# Altium project PROC051C_AWR1843BOOST_RevC.PrjPcb (part 1 of 7)
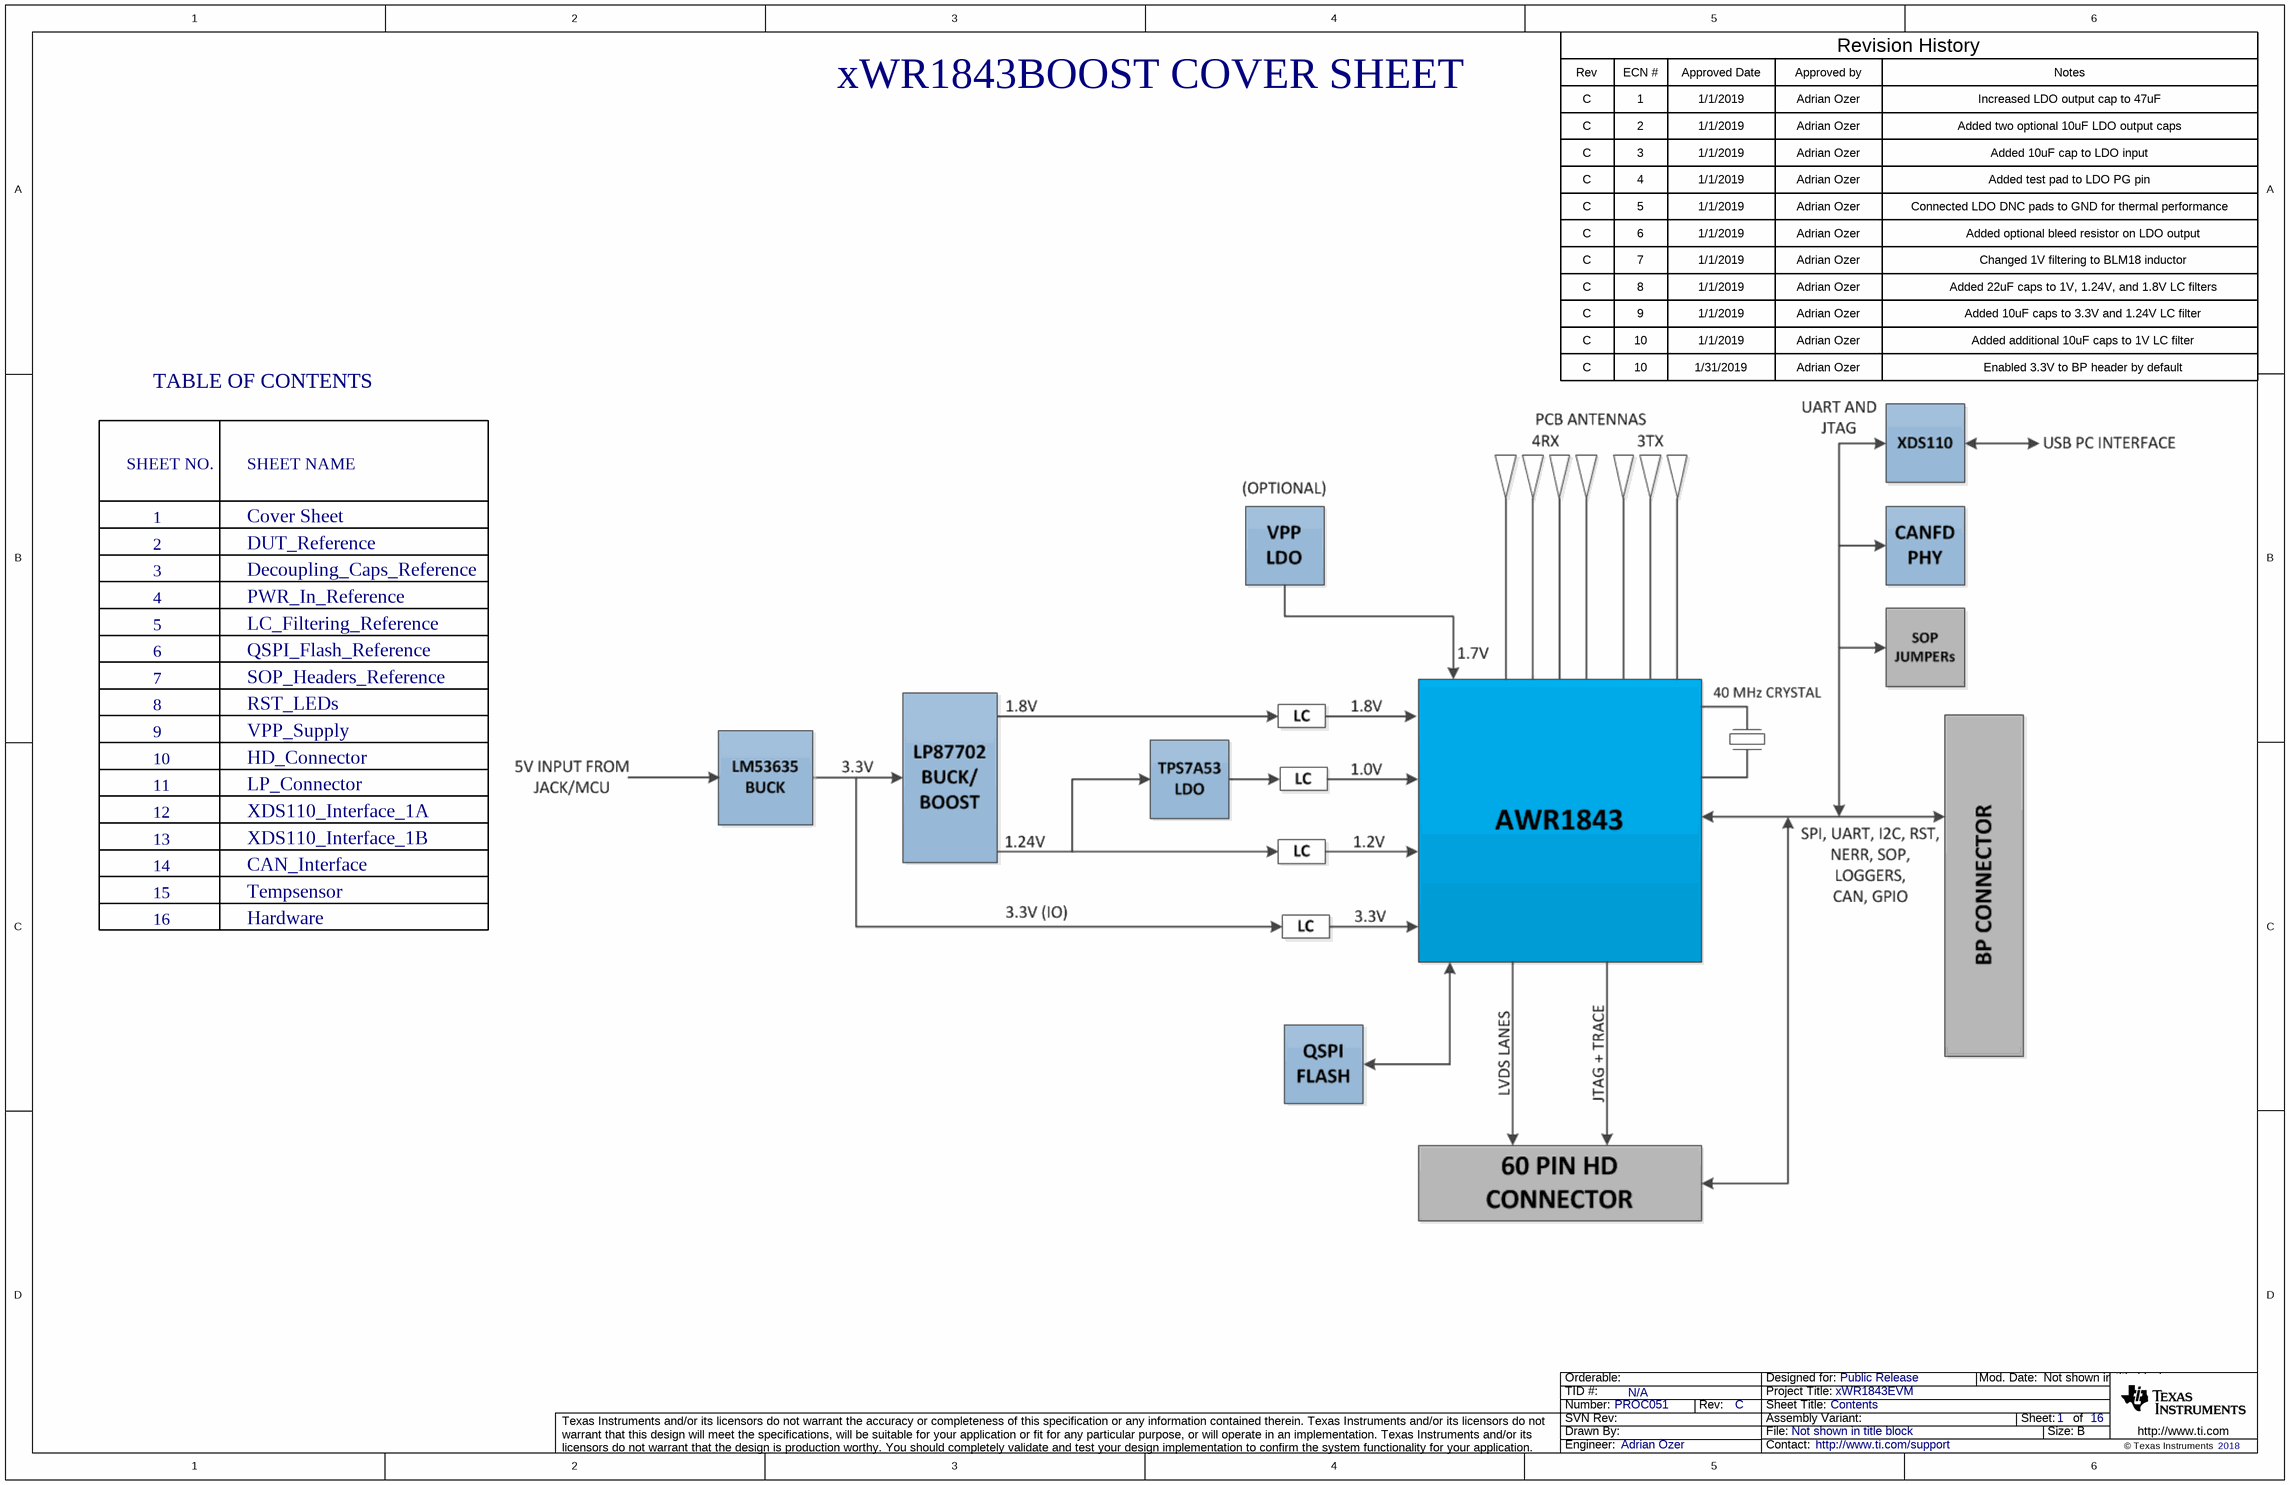
[diagram p0: PROC051C_Cover_Sheet.SchDoc]
CopyrightYear: 2018; PCB_Layout: Adrian Ozer; PCB_Rev: C; PRJ_Customer: Public Release; PRJ_Engineer: Adrian Ozer; PRJ_Number: PROC051; PRJ_Title: xWR1843EVM; SCH_Rev: C; TechSupport: http://www.ti.com/support; TID: N/A
16 sheets, 393 parts. Net scope: flat (ports and power ports of the same name join across sheets).
Board file: PROC051C_PCB.PcbDoc
Sheets:
  PROC051C_Cover_Sheet.SchDoc
  PROC051C_DUT_Reference.SchDoc
  PROC051C_Decoupling_Caps_Reference.SchDoc
  PROC051C_PWR_In_Reference.SchDoc
  PROC051C_LC_Filtering_Reference.SchDoc
  PROC051C_QSPI_Flash_Reference.SchDoc
  PROC051C_SOP_Headers_Reference.SchDoc
  PROC051C_RST_LEDs.SchDoc
  PROC051C_VPP_Supply.SchDoc
  PROC051C_HD Connector.SchDoc
  PROC051C_LP Connector.SchDoc
  PROC051C_XDS110 Interface_1A.SchDoc
  PROC051C_XDS110 Interface_1B.SchDoc
  PROC051C_CAN_Interface.SchDoc
  PROC051C_Tempsensor.SchDoc
  PROC051C_Hardware.SchDoc

## Sheet PROC051C_Cover_Sheet.SchDoc: Contents
size 431 x 279 mm; Date: Not shown in title block; ApprovedBy: Not shown in title block; CheckedBy: Not shown in title block; Author: Not shown in title block; CompanyName: Not shown in title block; Engineer: Not shown in title block; Organization: Not shown in title block; Address1: Not shown in title block; Address2: Not shown in title block; Address3: Not shown in title block; Address4: Not shown in title block; DocumentNumber: 1; Revision: Use project parameter SCH_Rev; SheetNumber: 1; SheetTotal: 16; PageSetup: Record=PageOptions|CenterHorizontal=True|CenterVertical=True|PrintScale=0.64|XCorrection=1.00|YCorrection=1.00|PrintKind=0|BorderSize=5000000|LeftOffset=0|BottomOffset=0|Orientation=2|PaperLength=1000|PaperWidth=1000|Scale=100|PaperSource=15|PrintQuality=600|MediaType=1|DitherType=10|PrintScaleMode=1|PaperKind=Letter; CurrentTime: Not shown in title block; CurrentDate: Not shown in title block; Time: Not shown in title block; DocumentFullPathAndName: Not shown in title block; DocumentName: Not shown in title block; ModifiedDate: Not shown in title block; ImagePath: Not shown in title block

### Notes on the sheet
- xWR1843BOOST COVER SHEET
- Rev
- C
- ECN #
- 1
- Approved Date
- 1/1/2019
- Approved by
- Adrian Ozer
- Revision History
- Notes
- Increased LDO output cap to 47uF
- 2
- 3
- Added two optional 10uF LDO output caps
- Added 10uF cap to LDO input
- 4
- 5
- 6
- Added test pad to LDO PG pin
- Connected LDO DNC pads to GND for thermal performance
- Added optional bleed resistor on LDO output
- 7
- 8
- Changed 1V filtering to BLM18 inductor
- Added 22uF caps to 1V, 1.24V, and 1.8V LC filters
- 9
- 10
- 1/31/2019
- Added 10uF caps to 3.3V and 1.24V LC filter
- Added additional 10uF caps to 1V LC filter
- Enabled 3.3V to BP header by default
- TABLE OF CONTENTS
- SHEET NO.
- SHEET NAME
- Cover Sheet
- DUT_Reference
- Decoupling_Caps_Reference
- PWR_In_Reference
- LC_Filtering_Reference
- QSPI_Flash_Reference
- SOP_Headers_Reference
- RST_LEDs
- VPP_Supply
- HD_Connector
- 11
- 12
- LP_Connector
- XDS110_Interface_1A
- 13
- 15
- 14
- XDS110_Interface_1B
- Tempsensor
- CAN_Interface
- 16
- Hardware
- Drawn By:
- SVN Rev:
- Number:
- TID #:
- Orderable:
- Rev:
- Sheet Title:
- File:
- Project Title:
- Designed for:
- Assembly Variant:
- Mod. Date:
- Sheet:
- Size:
- of
- B
- http://www.ti.com
- Texas Instruments and/or its licensors do not warrant the accuracy or completeness of this specification or any information contained therein. Texas Instruments and/or its licensors do not warrant that this design will meet the specifications, will be suitable for your application or fit for any particular purpose, or will operate in an implementation. Texas Instruments and/or its licensors do not warrant that the design is production worthy. You should completely validate and test your design implementation to confirm the system functionality for your application.
- Engineer:
- Contact:
- © Texas Instruments

## Sheet PROC051C_DUT_Reference.SchDoc: DUT
size 431 x 279 mm; Date: Not shown in title block; ApprovedBy: Not shown in title block; CheckedBy: Not shown in title block; Author: Not shown in title block; CompanyName: Not shown in title block; Engineer: Not shown in title block; Organization: Not shown in title block; Address1: Not shown in title block; Address2: Not shown in title block; Address3: Not shown in title block; Address4: Not shown in title block; DocumentNumber: 2; Revision: Use project parameter SCH_Rev; SheetNumber: 2; SheetTotal: 16; PageSetup: Record=PageOptions|CenterHorizontal=True|CenterVertical=True|PrintScale=1.00|XCorrection=1.00|YCorrection=1.00|PrintKind=0|BorderSize=5000000|LeftOffset=0|BottomOffset=0|Orientation=2|PaperLength=1000|PaperWidth=1000|Scale=100|PaperSource=15|PrintQuality=-3|MediaType=1|DitherType=10|PrintScaleMode=1|PaperKind=Letter|PaperIndex=1; CurrentTime: Not shown in title block; CurrentDate: Not shown in title block; Time: Not shown in title block; DocumentFullPathAndName: Not shown in title block; DocumentName: Not shown in title block; ModifiedDate: Not shown in title block; ImagePath: Not shown in title block
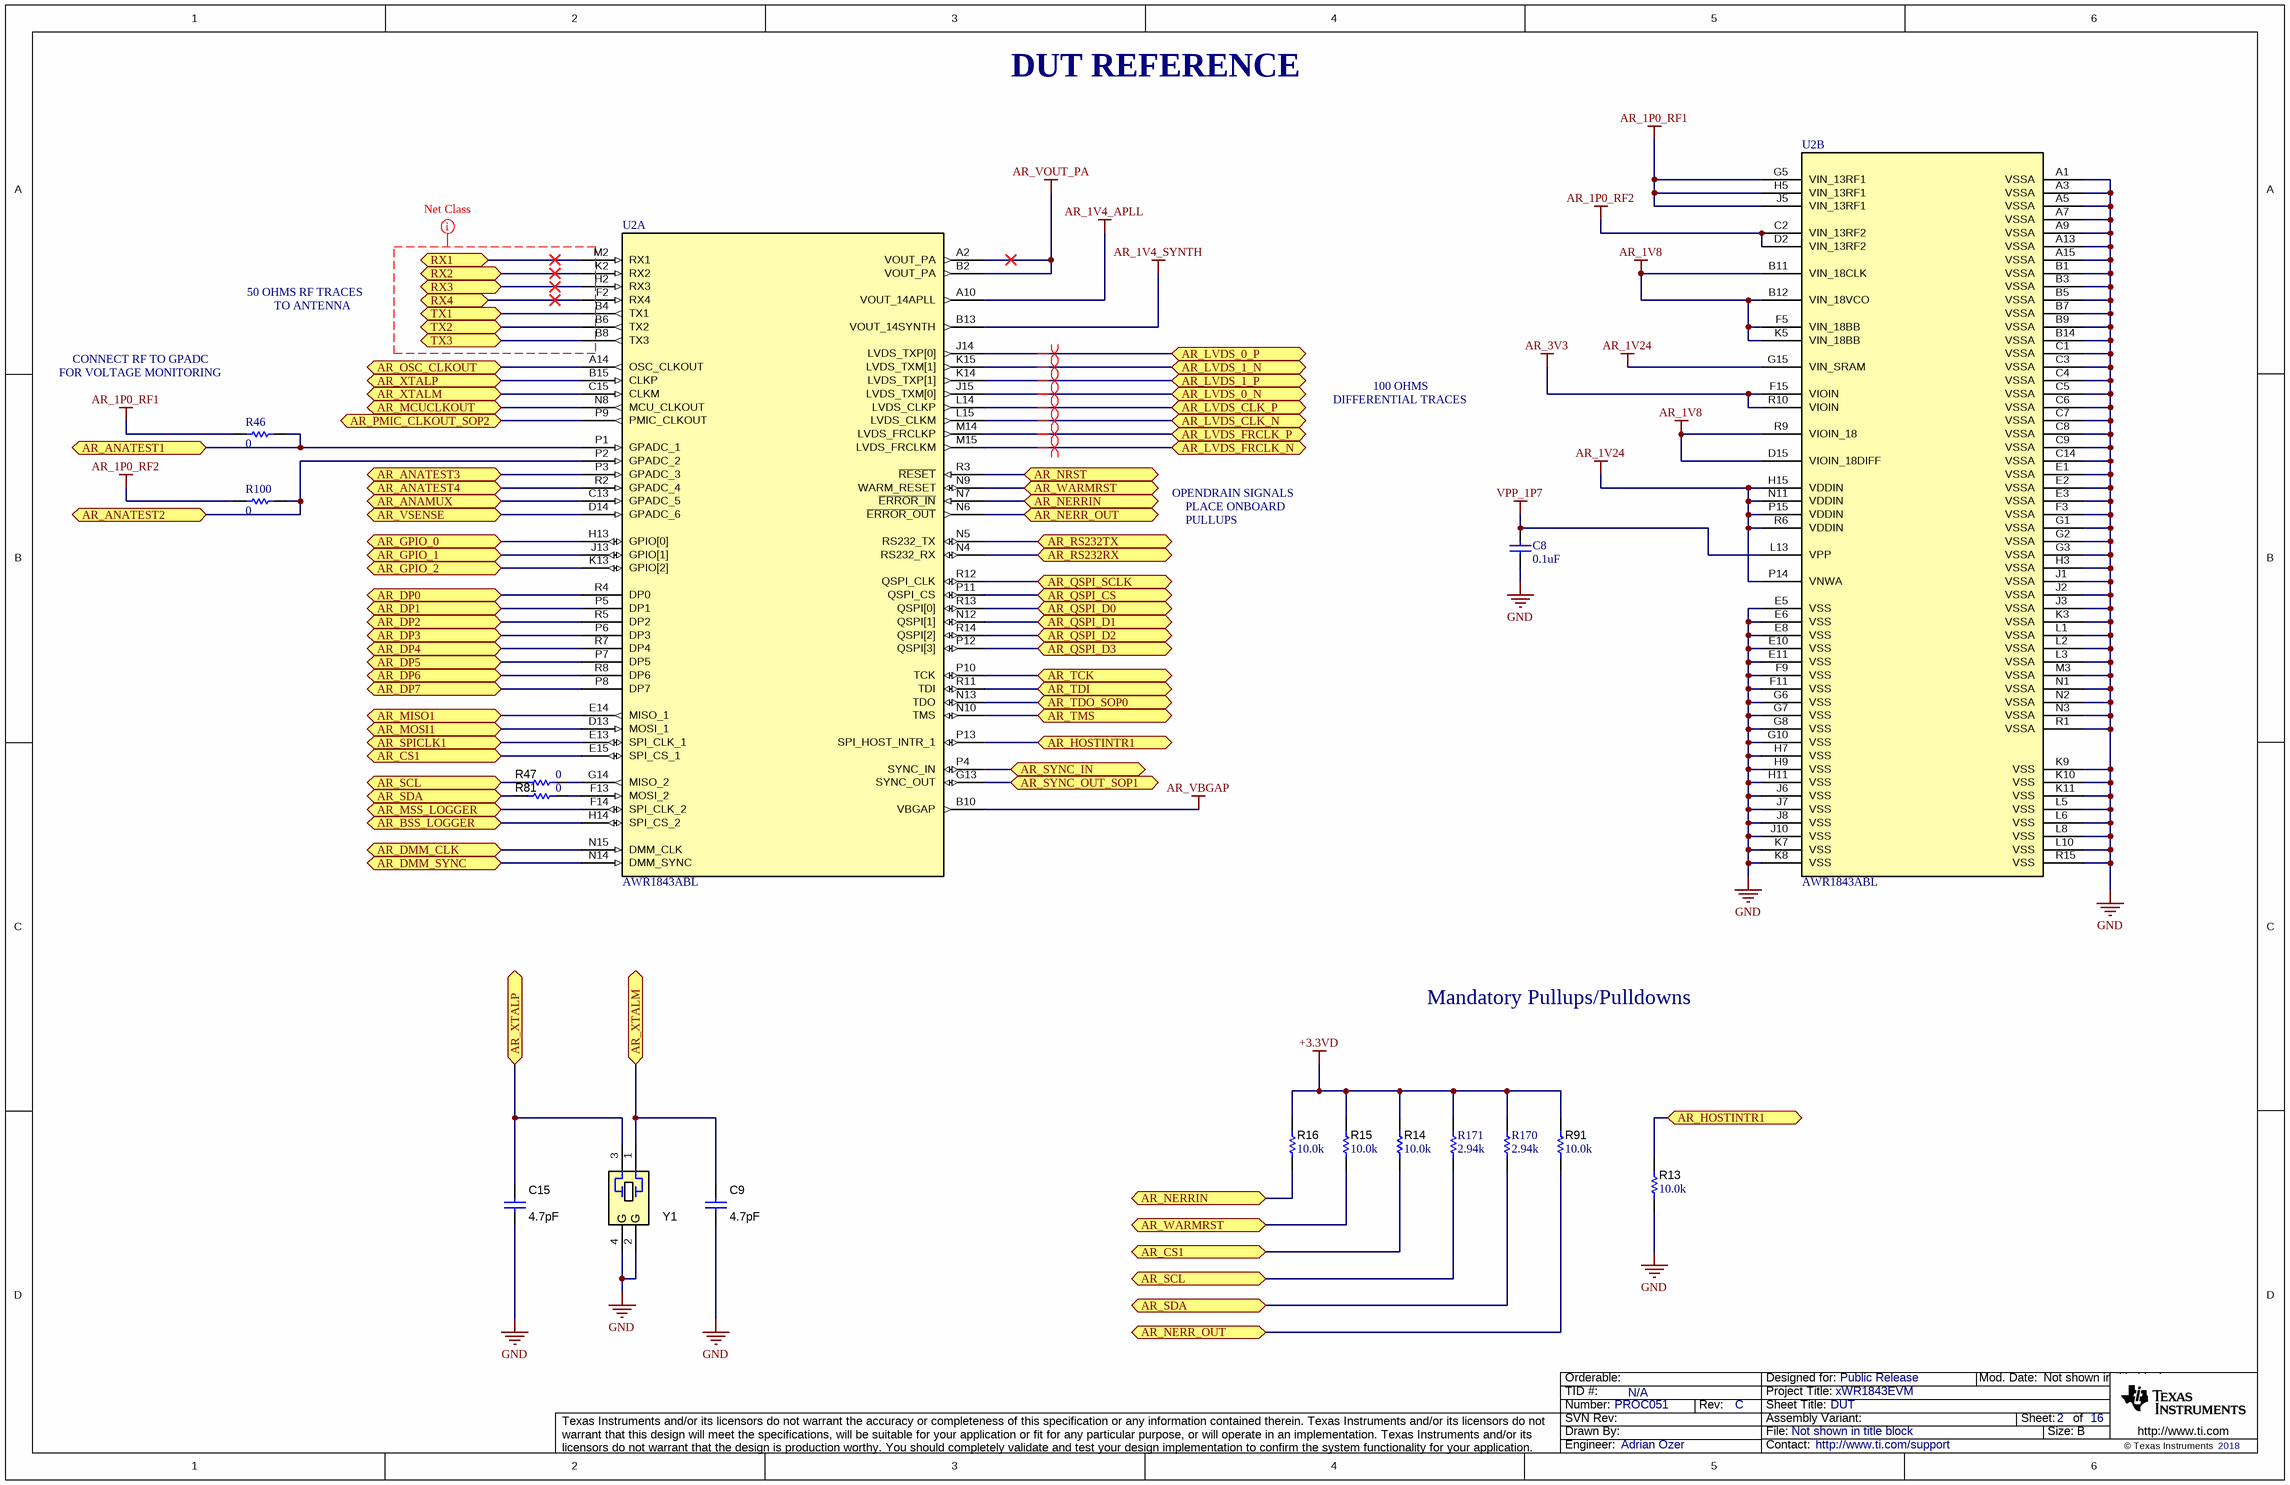
[diagram p1: PROC051C_DUT_Reference.SchDoc]

### Parts
C8  ValueDisplayed: 0.1uF  [0201]  (hidden comment: GRM033C71A104KE14D)
C9  ValueDisplayed: 4.7pF  [0402L]  (hidden comment: GJM1555C1H4R7BB01D)
C15  ValueDisplayed: 4.7pF  [0402L]  (hidden comment: GJM1555C1H4R7BB01D)
R13  ValueDisplayed: 10.0k  [0402L]  (hidden comment: CRCW040210K0FKED)
R14  ValueDisplayed: 10.0k  [0402L]  (hidden comment: CRCW040210K0FKED)
R15  ValueDisplayed: 10.0k  [0402L]  (hidden comment: CRCW040210K0FKED)
R16  ValueDisplayed: 10.0k  [0402L]  (hidden comment: CRCW040210K0FKED)
R46  ValueDisplayed: 0  [0402]  (hidden comment: CRCW04020000Z0ED)
R47  value 0  [0402L]  (hidden comment: Resistor)
R81  value 0  [0402L]  (hidden comment: Resistor)
R91  ValueDisplayed: 10.0k  [0402L]  (hidden comment: CRCW040210K0FKED)
R100  ValueDisplayed: 0  [0402]  (hidden comment: CRCW04020000Z0ED)
R170  ValueDisplayed: 2.94k  [0402]  (hidden comment: CRCW04022K94FKED)
R171  ValueDisplayed: 2.94k  [0402]  (hidden comment: CRCW04022K94FKED)
U2  AWR1843ABL  [ABL0161B]  (parts A,B of 2)
Y1  CX3225SA40000D0PTWCC  [Kyocera_CX3225SA]  (value not drawn)

### Ports
AR_ANAMUX, AR_ANATEST1, AR_ANATEST2, AR_ANATEST3, AR_ANATEST4, AR_BSS_LOGGER, AR_CS1, AR_DMM_CLK, AR_DMM_SYNC, AR_DP0, AR_DP1, AR_DP2, AR_DP3, AR_DP4, AR_DP5, AR_DP6, AR_DP7, AR_GPIO_0, AR_GPIO_1, AR_GPIO_2, AR_HOSTINTR1, AR_LVDS_0_N, AR_LVDS_0_P, AR_LVDS_1_N, AR_LVDS_1_P, AR_LVDS_CLK_N, AR_LVDS_CLK_P, AR_LVDS_FRCLK_N, AR_LVDS_FRCLK_P, AR_MCUCLKOUT, AR_MISO1, AR_MOSI1, AR_MSS_LOGGER, AR_NERR_OUT, AR_NERRIN, AR_NRST, AR_OSC_CLKOUT, AR_PMIC_CLKOUT_SOP2, AR_QSPI_CS, AR_QSPI_D0, AR_QSPI_D1, AR_QSPI_D2, AR_QSPI_D3, AR_QSPI_SCLK, AR_RS232RX, AR_RS232TX, AR_SCL, AR_SDA, AR_SPICLK1, AR_SYNC_IN, AR_SYNC_OUT_SOP1, AR_TCK, AR_TDI, AR_TDO_SOP0, AR_TMS, AR_VSENSE, AR_WARMRST, AR_XTALM, AR_XTALP, RX1, RX2, RX3, RX4, TX1, TX2, TX3

### Nets
+3.3VD: R14.2 R15.2 R16.2 R91.2 R170.2 R171.2
AR_1P0_RF1: R46.2 U2.G5(VIN_13RF1) U2.H5(VIN_13RF1) U2.J5(VIN_13RF1)
AR_1P0_RF2: R100.2 U2.C2(VIN_13RF2) U2.D2(VIN_13RF2)
AR_1V4_APLL: U2.A10(VOUT_14APLL)
AR_1V4_SYNTH: U2.B13(VOUT_14SYNTH)
AR_1V8: U2.B11(VIN_18CLK) U2.B12(VIN_18VCO) U2.D15(VIOIN_18DIFF) U2.F5(VIN_18BB) U2.K5(VIN_18BB) U2.R9(VIOIN_18)
AR_1V24: U2.G15(VIN_SRAM) U2.H15(VDDIN) U2.N11(VDDIN) U2.P14(VNWA) U2.P15(VDDIN) U2.R6(VDDIN)
AR_3V3: U2.F15(VIOIN) U2.R10(VIOIN)
AR_VBGAP: U2.B10(VBGAP)
AR_VOUT_PA: U2.A2(VOUT_PA) U2.B2(VOUT_PA)
GND: C8.2 C9.1 C15.1 R13.1 U2.A1(VSSA) U2.A3(VSSA) U2.A5(VSSA) U2.A7(VSSA) U2.A9(VSSA) U2.A13(VSSA) U2.A15(VSSA) U2.B1(VSSA) U2.B3(VSSA) U2.B5(VSSA) U2.B7(VSSA) U2.B9(VSSA) U2.B14(VSSA) U2.C1(VSSA) U2.C3(VSSA) U2.C4(VSSA) U2.C5(VSSA) U2.C6(VSSA) U2.C7(VSSA) U2.C8(VSSA) U2.C9(VSSA) U2.C14(VSSA) U2.E1(VSSA) U2.E2(VSSA) U2.E3(VSSA) U2.E5(VSS) U2.E6(VSS) U2.E8(VSS) U2.E10(VSS) U2.E11(VSS) U2.F3(VSSA) U2.F9(VSS) U2.F11(VSS) U2.G1(VSSA) U2.G2(VSSA) U2.G3(VSSA) U2.G6(VSS) U2.G7(VSS) U2.G8(VSS) U2.G10(VSS) U2.H3(VSSA) U2.H7(VSS) U2.H9(VSS) U2.H11(VSS) U2.J1(VSSA) U2.J2(VSSA) U2.J3(VSSA) U2.J6(VSS) U2.J7(VSS) U2.J8(VSS) U2.J10(VSS) U2.K3(VSSA) U2.K7(VSS) U2.K8(VSS) U2.K9(VSS) U2.K10(VSS) U2.K11(VSS) U2.L1(VSSA) U2.L2(VSSA) U2.L3(VSSA) U2.L5(VSS) U2.L6(VSS) U2.L8(VSS) U2.L10(VSS) U2.M3(VSSA) U2.N1(VSSA) U2.N2(VSSA) U2.N3(VSSA) U2.R1(VSSA) U2.R15(VSS) Y1.2(GND) Y1.4(GND)
VPP_1P7: C8.1 U2.L13(VPP)
AR_ANAMUX: U2.C13(GPADC_5) ; port AR_ANAMUX
AR_ANATEST1: R46.1 U2.P1(GPADC_1) ; port AR_ANATEST1
AR_ANATEST2: R100.1 U2.P2(GPADC_2) ; port AR_ANATEST2
AR_ANATEST3: U2.P3(GPADC_3) ; port AR_ANATEST3
AR_ANATEST4: U2.R2(GPADC_4) ; port AR_ANATEST4
AR_BSS_LOGGER: U2.H14(SPI_CS_2) ; port AR_BSS_LOGGER
AR_CS1: R14.1 U2.E15(SPI_CS_1) ; port AR_CS1
AR_DMM_CLK: U2.N15(DMM_CLK) ; port AR_DMM_CLK
AR_DMM_SYNC: U2.N14(DMM_SYNC) ; port AR_DMM_SYNC
AR_DP0: U2.R4(DP0) ; port AR_DP0
AR_DP1: U2.P5(DP1) ; port AR_DP1
AR_DP2: U2.R5(DP2) ; port AR_DP2
AR_DP3: U2.P6(DP3) ; port AR_DP3
AR_DP4: U2.R7(DP4) ; port AR_DP4
AR_DP5: U2.P7(DP5) ; port AR_DP5
AR_DP6: U2.R8(DP6) ; port AR_DP6
AR_DP7: U2.P8(DP7) ; port AR_DP7
AR_GPIO_0: U2.H13(GPIO[0]) ; port AR_GPIO_0
AR_GPIO_1: U2.J13(GPIO[1]) ; port AR_GPIO_1
AR_GPIO_2: U2.K13(GPIO[2]) ; port AR_GPIO_2
AR_HOSTINTR1: R13.2 U2.P13(SPI_HOST_INTR_1) ; port AR_HOSTINTR1
AR_LVDS_0_N: U2.J15(LVDS_TXM[0]) ; port AR_LVDS_0_N
AR_LVDS_0_P: U2.J14(LVDS_TXP[0]) ; port AR_LVDS_0_P
AR_LVDS_1_N: U2.K15(LVDS_TXM[1]) ; port AR_LVDS_1_N
AR_LVDS_1_P: U2.K14(LVDS_TXP[1]) ; port AR_LVDS_1_P
AR_LVDS_CLK_N: U2.L15(LVDS_CLKM) ; port AR_LVDS_CLK_N
AR_LVDS_CLK_P: U2.L14(LVDS_CLKP) ; port AR_LVDS_CLK_P
AR_LVDS_FRCLK_N: U2.M15(LVDS_FRCLKM) ; port AR_LVDS_FRCLK_N
AR_LVDS_FRCLK_P: U2.M14(LVDS_FRCLKP) ; port AR_LVDS_FRCLK_P
AR_MCUCLKOUT: U2.N8(MCU_CLKOUT) ; port AR_MCUCLKOUT
AR_MISO1: U2.E14(MISO_1) ; port AR_MISO1
AR_MOSI1: U2.D13(MOSI_1) ; port AR_MOSI1
AR_MSS_LOGGER: U2.F14(SPI_CLK_2) ; port AR_MSS_LOGGER
AR_NERR_OUT: R91.1 U2.N6(~{ERROR_OUT}) ; port AR_NERR_OUT
AR_NERRIN: R16.1 U2.N7(~{ERROR_IN}) ; port AR_NERRIN
AR_NRST: U2.R3(~{RESET}) ; port AR_NRST
AR_OSC_CLKOUT: U2.A14(OSC_CLKOUT) ; port AR_OSC_CLKOUT
AR_PMIC_CLKOUT_SOP2: U2.P9(PMIC_CLKOUT) ; port AR_PMIC_CLKOUT_SOP2
AR_QSPI_CS: U2.P11(QSPI_CS) ; port AR_QSPI_CS
AR_QSPI_D0: U2.R13(QSPI[0]) ; port AR_QSPI_D0
AR_QSPI_D1: U2.N12(QSPI[1]) ; port AR_QSPI_D1
AR_QSPI_D2: U2.R14(QSPI[2]) ; port AR_QSPI_D2
AR_QSPI_D3: U2.P12(QSPI[3]) ; port AR_QSPI_D3
AR_QSPI_SCLK: U2.R12(QSPI_CLK) ; port AR_QSPI_SCLK
AR_RS232RX: U2.N4(RS232_RX) ; port AR_RS232RX
AR_RS232TX: U2.N5(RS232_TX) ; port AR_RS232TX
AR_SCL: R47.2 R171.1 ; port AR_SCL
AR_SDA: R81.2 R170.1 ; port AR_SDA
AR_SPICLK1: U2.E13(SPI_CLK_1) ; port AR_SPICLK1
AR_SYNC_IN: U2.P4(SYNC_IN) ; port AR_SYNC_IN
AR_SYNC_OUT_SOP1: U2.G13(SYNC_OUT) ; port AR_SYNC_OUT_SOP1
AR_TCK: U2.P10(TCK) ; port AR_TCK
AR_TDI: U2.R11(TDI) ; port AR_TDI
AR_TDO_SOP0: U2.N13(TDO) ; port AR_TDO_SOP0
AR_TMS: U2.N10(TMS) ; port AR_TMS
AR_VSENSE: U2.D14(GPADC_6) ; port AR_VSENSE
AR_WARMRST: R15.1 U2.N9(WARM_RESET) ; port AR_WARMRST
AR_XTALM: C9.2 U2.C15(CLKM) Y1.1 ; port AR_XTALM
AR_XTALP: C15.2 U2.B15(CLKP) Y1.3 ; port AR_XTALP
RX1: U2.M2(RX1) ; port RX1
RX2: U2.K2(RX2) ; port RX2
RX3: U2.H2(RX3) ; port RX3
RX4: U2.F2(RX4) ; port RX4
TX1: U2.B4(TX1) ; port TX1
TX2: U2.B6(TX2) ; port TX2
TX3: U2.B8(TX3) ; port TX3
NetR47_1: R47.1 U2.G14(MISO_2)
NetR81_1: R81.1 U2.F13(MOSI_2)

### Layout directives
differential pair: AR_LVDS_0_N, AR_LVDS_0_P, AR_LVDS_1_N, AR_LVDS_1_P, AR_LVDS_CLK_N, AR_LVDS_CLK_P, AR_LVDS_FRCLK_N, AR_LVDS_FRCLK_P
net class RX_TX: (no net found under the mark)

### Notes on the sheet
- DUT REFERENCE
- 50 OHMS RF TRACES
- CONNECT RF TO GPADC
- TO ANTENNA
- FOR VOLTAGE MONITORING
- DIFFERENTIAL TRACES
- 100 OHMS
- OPENDRAIN SIGNALS
- PLACE ONBOARD
- PULLUPS
- Mandatory Pullups/Pulldowns
- Drawn By:
- SVN Rev:
- Number:
- TID #:
- Orderable:
- Rev:
- Sheet Title:
- File:
- Project Title:
- Designed for:
- Assembly Variant:
- Mod. Date:
- Sheet:
- Size:
- of
- B
- http://www.ti.com
- Texas Instruments and/or its licensors do not warrant the accuracy or completeness of this specification or any information contained therein. Texas Instruments and/or its licensors do not warrant that this design will meet the specifications, will be suitable for your application or fit for any particular purpose, or will operate in an implementation. Texas Instruments and/or its licensors do not warrant that the design is production worthy. You should completely validate and test your design implementation to confirm the system functionality for your application.
- Engineer:
- Contact:
- © Texas Instruments
- (in symbol CMP-0004694-3) G

### Library data of the parts
C8 = CMP-0064969-1: CAP, CERM, 0.1 uF, 10 V,+/- 10%, X7S, 0201; Manufacturer: MuRata; TaMin_C: -55°C; Polarized: N; SizeAreaWB_mm2: 2.08; Value1: Unknown; U/M: EA; Value: 0.1uF; TaMax_C: 125°C; SizeZ_mm: 0.26; SizeX_mm: 0.6; SizeY_mm: 0.3; Value2: 10V; SizeArea_mm2: 0.18; CompType: Capacitor; Cap_F: 100nF; AEC Category: Q200; ComponentLink1URL: http://search.murata.co.jp/Ceramy/image/img/A01X/G101/ENG/GRM033C71A104KE14-01.pdf; Supplier Part Number 2: 81-GRM033C71A104KE4D; Publisher: Texas Instruments; Supplier 2: Mouser; TempCo: X7S; Published: 2008-06-19; RoHS: Y; MountType: SMT; Supplier 1: Digi-Key; PackageReference: 0201; Tolerance_%: 10%; Cap_Case: 0201; LatestRevisionDate: 2017-06-05; PartNumber: GRM033C71A104KE14D; AEC Qualified: N; VDC_V: 10V; ComponentLink1Description: Datasheet link; AEC Grade: N/A; Supplier Part Number 1: 490-14450-1-ND; Technology: Ceramic
C9 C15 = CMP-0006367-2: CAP, CERM, 4.7 pF, 50 V, +/- 2%, C0G/NP0, 0402; Manufacturer: MuRata; TaMin_C: -55°C; Polarized: N; SizeAreaWB_mm2: 3; Value1: Unknown; U/M: EA; Value: 4.7pF; TaMax_C: 125°C; SizeZ_mm: 0.6; SizeX_mm: 1; SizeY_mm: 0.5; Cap_Case: 0402; Value2: 50V; CompType: Capacitor; AEC Category: Q200; Supplier Part Number 2: 81-GJM1555C1H4R7BB01; Publisher: Texas Instruments; Supplier 2: Mouser; TempCo: C0G/NP0; Published: 2008-06-19; RoHS: Y; MountType: SMT; Supplier 1: Digi-Key; PackageReference: 0402; Tolerance_%: 2%; SizeArea_mm2: 0.5; LatestRevisionDate: 2017-03-09; PartNumber: GJM1555C1H4R7BB01D; AEC Qualified: N; Cap_F: 4.7pF; VDC_V: 50V; ComponentLink1Description: Datasheet link; AEC Grade: N/A; Supplier Part Number 1: 490-8102-1-ND; Technology: Ceramic; ComponentLink1URL: http://psearch.murata.com/capacitor/product/GJM1555C1H4R7BB01%23.pdf
R13-R16 R91 = CMP-0025958-3: RES, 10.0 k, 1%, 0.063 W, AEC-Q200 Grade 0, 0402; Manufacturer: Vishay-Dale; Power_W: 63mW; TempCo: 100 ppm/C; Value_Code: 10k0; Value: 10.0k; EIA_Code: E96; Res_ohm: 10k; SizeX_mm: 1; SizeY_mm: 0.5; SizeZ_mm: 0.6; Value2: 0.063W; AEC Qualified: Y; VDC_V: 50V; AEC Category: Q200; AEC Grade: 0; Supplier Part Number 2: 52K6595; Supplier 2: Newark; Supplier Part Number 3: 71-CRCW0402-10K-E3; Supplier 3: Mouser; RoHS: E; Value1: 1%; MountType: SMT; Supplier 1: Digi-Key; PackageReference: 0402; Tolerance_%: 1%; SizeArea_mm2: 0.5; CompType: Resistor; PartNumber: CRCW040210K0FKED; ComponentLink1Description: Datasheet link; Supplier Part Number 1: 541-10.0KLCT-ND; Technology: Thick Film; ComponentLink1URL: http://www.vishay.com/docs/20035/dcrcwe3.pdf
R46 R100 = CMP-0026822-3: RES, 0, 5%, 0.063 W, AEC-Q200 Grade 0, 0402; Manufacturer: Vishay-Dale; Power_W: 63mW; TempCo: 200 ppm/C; Value_Code: 0000; Value: 0; EIA_Code: E24; SizeX_mm: 1; SizeY_mm: 0.5; SizeZ_mm: 0.6; Value2: 0.063W; CompType: Resistor; AEC Qualified: Y; VDC_V: 50V; AEC Category: Q200; Supplier Part Number 2: 52K6543; Supplier 2: Newark; Supplier Part Number 3: 71-CRCW0402-0-E3; Supplier 3: Mouser; RoHS: E; Value1: 5%; MountType: SMT; Supplier 1: Digi-Key; PackageReference: 0402; Tolerance_%: 5%; Res_ohm: 0; SizeArea_mm2: 0.5; PartNumber: CRCW04020000Z0ED; ComponentLink1Description: Datasheet link; Supplier Part Number 1: 541-0.0JCT-ND; Technology: Thick Film; ComponentLink1URL: http://www.vishay.com/docs/20035/dcrcwe3.pdf; AEC Grade: 0
R47 R81 = CMP-0026822-3: RES, 0, 5%, 0.063 W, AEC-Q200 Grade 0, 0402; PartNumber: CRCW04020000Z0ED; Manufacturer: Vishay-Dale; Value_Code: 0000; Power_W: 63mW; Value2: 0.063W; VDC_V: 50V; TempCo: 200 ppm/C; EIA_Code: E24; AEC Category: Q200; AEC Qualified: Y; SizeArea_mm2: 0.5; SizeX_mm: 1; SizeZ_mm: 0.6; CompType: Resistor; PackageReference: 0402; RoHS: E; Res_ohm: 0; Tolerance_%: 5%; Value1: 5%; MountType: SMT; Technology: Thick Film; ComponentLink1Description: Datasheet link; ComponentLink1URL: http://www.vishay.com/docs/20035/dcrcwe3.pdf; Supplier 1: Digi-Key; Supplier Part Number 1: 541-0.0JCT-ND; Supplier 2: Newark; Supplier Part Number 2: 52K6543; Supplier 3: Mouser; Supplier Part Number 3: 71-CRCW0402-0-E3; AEC Grade: 0; SizeY_mm: 0.5; ValueDisplayed: 0
R170 R171 = CMP-0026244-2: RES, 2.94 k, 1%, 0.063 W, AEC-Q200 Grade 0, 0402; Manufacturer: Vishay-Dale; Power_W: 63mW; TempCo: 100 ppm/C; Value_Code: 2k94; Value: 2.94k; EIA_Code: E96; SizeX_mm: 1; SizeY_mm: 0.5; SizeZ_mm: 0.6; Value2: 0.063W; AEC Qualified: Y; VDC_V: 50V; AEC Category: Q200; AEC Grade: 0; ComponentLink1URL: http://www.vishay.com/docs/20035/dcrcwe3.pdf; Supplier Part Number 2: 52K6814; Supplier 2: Newark; Supplier Part Number 3: 71-CRCW0402-2.94K-E3; Supplier 3: Mouser; RoHS: E; Value1: 1%; MountType: SMT; Supplier 1: Digi-Key; PackageReference: 0402; Tolerance_%: 1%; Res_ohm: 2.94k; SizeArea_mm2: 0.5; CompType: Resistor; PartNumber: CRCW04022K94FKED; ComponentLink1Description: Datasheet link; Supplier Part Number 1: 541-2.94KLCT-ND; Technology: Thick Film
U2 = CMP-0078239-1: AWR1843ABL, ABL0161B (FCBGA-161); Manufacturer: Texas Instruments; AEC Qualified: N; SizeArea_mm2: 108.16; CompType: IC; SizeAreaWB_mm2: 153.76; AEC Category: Q200; SizeY_mm: 10.4; SizeZ_mm: 1.17; PartNumber: AWR1843ABL; ComponentLink2Description: Product Folder; PackageDescription: FCBGA-161; PackageReference: ABL0161B; ComponentLink1Description: Datasheet Link; MountType: SMT; ComponentLink1URL: https://sps16.itg.ti.com/sites/KMS/crossdivteams/altium/docs/AWR1843_ballout_05Sep17.xlsx; ComponentLink2URL: TBD; Alternate Manufacturer: Texas Instruments; SizeX_mm: 10.4; PartId: 1
Y1 = CMP-0004694-3: Crystal, 40 MHz, 8pF, SMD; Manufacturer: Kyocera; TaMin_C: -40°C; Frequency Stability: +/-200ppm; SizeAreaWB_mm2: 14.7; Frequency_Fixed: 40MHz; TaMax_C: 125°C; SizeZ_mm: 0.8; SizeX_mm: 2.5; SizeY_mm: 3.2; SizeArea_mm2: 8; RoHS: Y; MountType: SMT; Supplier 1: Mouser; PackageReference: 3.2x2.5mm; CompType: Crystal; PartNumber: CX3225SA40000D0PTWCC; ComponentLink1Description: Datasheet Link; Supplier Part Number 1: 581-CX3225SA40D0PTWC; ComponentLink1URL: http://www.kyocera-crystal.jp/eng/wp-content/uploads/2016/10/cx3225sa_e.pdf

## Sheet PROC051C_Decoupling_Caps_Reference.SchDoc: Decoupling_caps
size 431 x 279 mm; Date: Not shown in title block; ApprovedBy: Not shown in title block; CheckedBy: Not shown in title block; Author: Not shown in title block; CompanyName: Not shown in title block; Engineer: Not shown in title block; Organization: Not shown in title block; Address1: Not shown in title block; Address2: Not shown in title block; Address3: Not shown in title block; Address4: Not shown in title block; DocumentNumber: 3; Revision: Use project parameter SCH_Rev; SheetNumber: 3; SheetTotal: 16; PageSetup: Record=PageOptions|CenterHorizontal=True|CenterVertical=True|PrintScale=1.00|XCorrection=1.00|YCorrection=1.00|PrintKind=0|BorderSize=5000000|LeftOffset=0|BottomOffset=0|Orientation=2|PaperLength=1000|PaperWidth=1000|Scale=100|PaperSource=15|PrintQuality=600|MediaType=1|DitherType=10|PaperKind=Letter|PrintScaleMode=1; CurrentTime: Not shown in title block; CurrentDate: Not shown in title block; Time: Not shown in title block; DocumentFullPathAndName: Not shown in title block; DocumentName: Not shown in title block; ModifiedDate: Not shown in title block; ImagePath: Not shown in title block
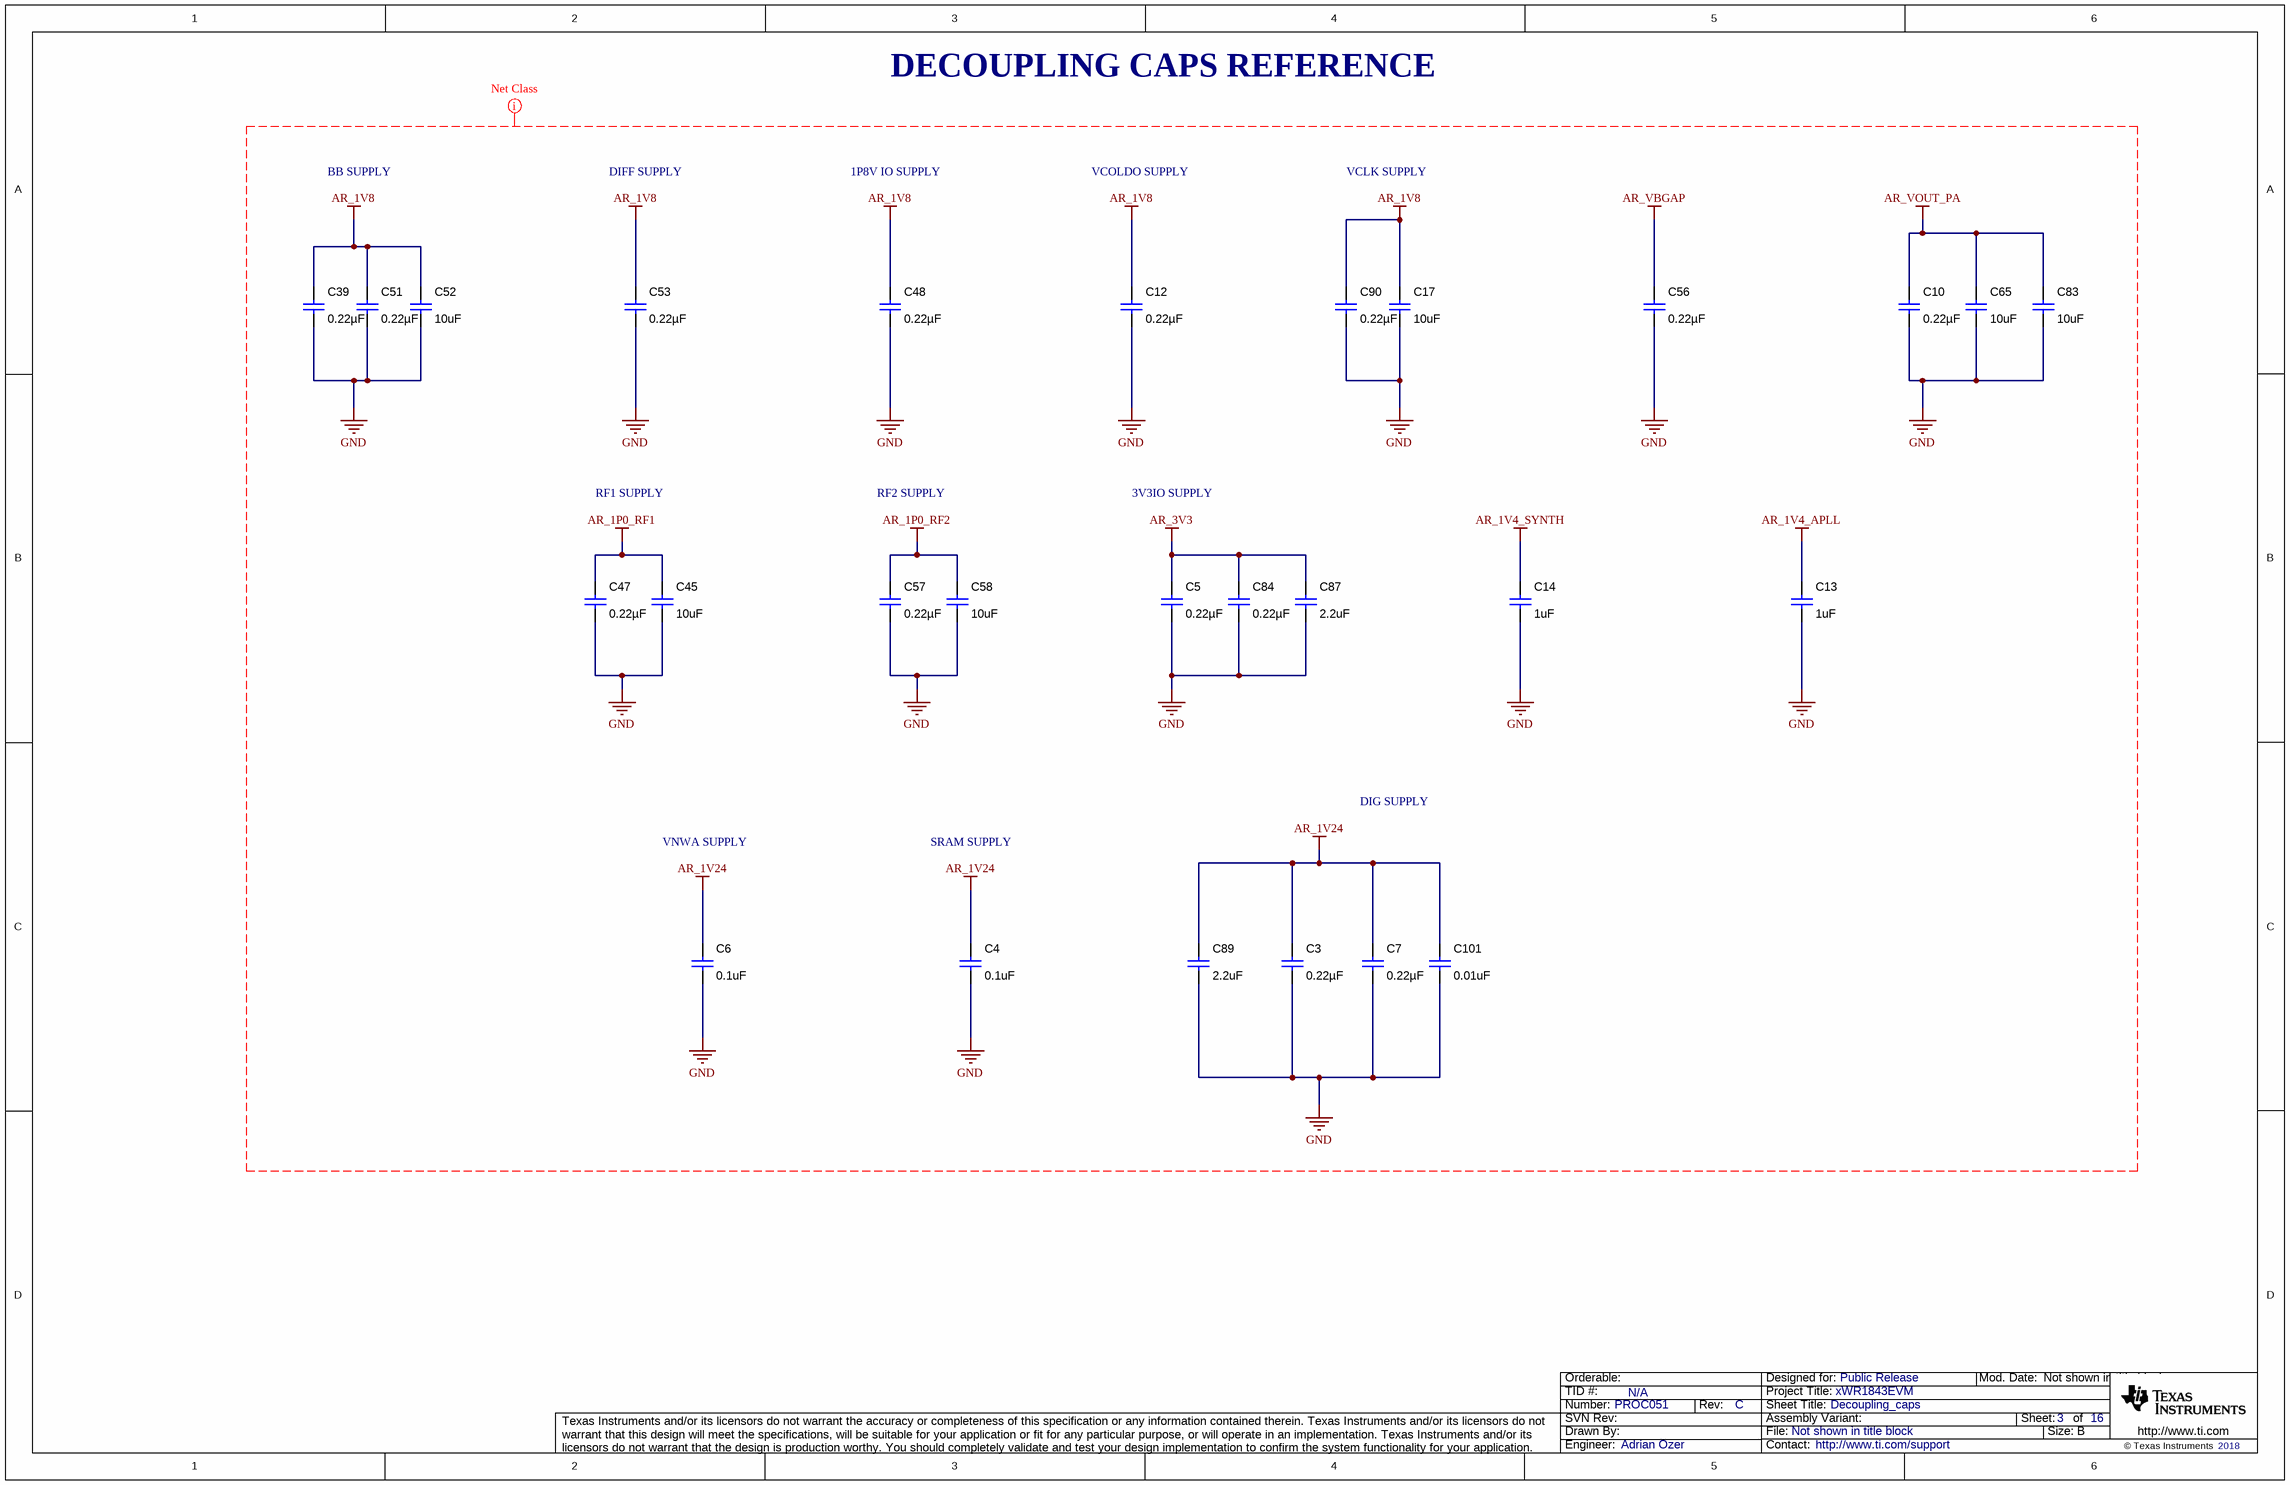
[diagram p2: PROC051C_Decoupling_Caps_Reference.SchDoc]

### Parts
C3  ValueDisplayed: 0.22µF  [0402L]  (hidden comment: GCM155R71C224KE02D)
C4  ValueDisplayed: 0.1uF  [0402L]  (hidden comment: GCM155R71C104KA55D)
C5  ValueDisplayed: 0.22µF  [0402L]  (hidden comment: GCM155R71C224KE02D)
C6  ValueDisplayed: 0.1uF  [0402L]  (hidden comment: GCM155R71C104KA55D)
C7  ValueDisplayed: 0.22µF  [0402L]  (hidden comment: GCM155R71C224KE02D)
C10  ValueDisplayed: 0.22µF  [0402L]  (hidden comment: GCM155R71C224KE02D)
C12  ValueDisplayed: 0.22µF  [0402L]  (hidden comment: GCM155R71C224KE02D)
C13  ValueDisplayed: 1uF  [0603]  (hidden comment: GCM188R71C105KA64D)
C14  ValueDisplayed: 1uF  [0603]  (hidden comment: GCM188R71C105KA64D)
C17  ValueDisplayed: 10uF  [0805_HV]  (hidden comment: GCM21BR71A106KE22L)
C39  ValueDisplayed: 0.22µF  [0402L]  (hidden comment: GCM155R71C224KE02D)
C45  ValueDisplayed: 10uF  [0805_HV]  (hidden comment: GCM21BR71A106KE22L)
C47  ValueDisplayed: 0.22µF  [0402L]  (hidden comment: GCM155R71C224KE02D)
C48  ValueDisplayed: 0.22µF  [0402L]  (hidden comment: GCM155R71C224KE02D)
C51  ValueDisplayed: 0.22µF  [0402L]  (hidden comment: GCM155R71C224KE02D)
C52  ValueDisplayed: 10uF  [0805_HV]  (hidden comment: GCM21BR71A106KE22L)
C53  ValueDisplayed: 0.22µF  [0402L]  (hidden comment: GCM155R71C224KE02D)
C56  ValueDisplayed: 0.22µF  [0402L]  (hidden comment: GCM155R71C224KE02D)
C57  ValueDisplayed: 0.22µF  [0402L]  (hidden comment: GCM155R71C224KE02D)
C58  ValueDisplayed: 10uF  [0805_HV]  (hidden comment: GCM21BR71A106KE22L)
C65  ValueDisplayed: 10uF  [0805_HV]  (hidden comment: GCM21BR71A106KE22L)
C83  ValueDisplayed: 10uF  [0805_HV]  (hidden comment: GCM21BR71A106KE22L)
C84  ValueDisplayed: 0.22µF  [0402L]  (hidden comment: GCM155R71C224KE02D)
C87  ValueDisplayed: 2.2uF  [0603]  (hidden comment: GCM188R70J225KE22D)
C89  ValueDisplayed: 2.2uF  [0603]  (hidden comment: GCM188R70J225KE22D)
C90  ValueDisplayed: 0.22µF  [0402L]  (hidden comment: GCM155R71C224KE02D)
C101  ValueDisplayed: 0.01uF  [0402L]  (hidden comment: GCM155R71E103KA37D)

### Nets
AR_1P0_RF1: C45.2 C47.2
AR_1P0_RF2: C57.2 C58.2
AR_1V4_APLL: C13.2
AR_1V4_SYNTH: C14.2
AR_1V8: C12.2 C17.2 C39.2 C48.2 C51.2 C52.2 C53.2 C90.2
AR_1V24: C3.2 C4.2 C6.2 C7.2 C89.2 C101.1
AR_3V3: C5.2 C84.2 C87.2
AR_VBGAP: C56.2
AR_VOUT_PA: C10.2 C65.2 C83.2
GND: C3.1 C4.1 C5.1 C6.1 C7.1 C10.1 C12.1 C13.1 C14.1 C17.1 C39.1 C45.1 C47.1 C48.1 C51.1 C52.1 C53.1 C56.1 C57.1 C58.1 C65.1 C83.1 C84.1 C87.1 C89.1 C90.1 C101.2

### Layout directives
net class PWR: AR_1P0_RF1, AR_1P0_RF2, AR_1V4_APLL, AR_1V4_SYNTH, AR_1V8, AR_1V24, AR_3V3, AR_VBGAP, AR_VOUT_PA, GND

### Notes on the sheet
- DECOUPLING CAPS REFERENCE
- BB SUPPLY
- DIFF SUPPLY
- 1P8V IO SUPPLY
- VCOLDO SUPPLY
- VCLK SUPPLY
- RF1 SUPPLY
- RF2 SUPPLY
- 3V3IO SUPPLY
- DIG SUPPLY
- VNWA SUPPLY
- SRAM SUPPLY
- Drawn By:
- SVN Rev:
- Number:
- TID #:
- Orderable:
- Rev:
- Sheet Title:
- File:
- Project Title:
- Designed for:
- Assembly Variant:
- Mod. Date:
- Sheet:
- Size:
- of
- B
- http://www.ti.com
- Texas Instruments and/or its licensors do not warrant the accuracy or completeness of this specification or any information contained therein. Texas Instruments and/or its licensors do not warrant that this design will meet the specifications, will be suitable for your application or fit for any particular purpose, or will operate in an implementation. Texas Instruments and/or its licensors do not warrant that the design is production worthy. You should completely validate and test your design implementation to confirm the system functionality for your application.
- Engineer:
- Contact:
- © Texas Instruments

### Library data of the parts
C3 C5 C7 C10 C12 C39 C47 C48 C51 C53 C56 C57 C84 C90 = CMP-0078265-1: CAP, CERM, 0.22 µF, 16 V,+/- 10%, X7R, AEC-Q200 Grade 1, 0402; Manufacturer: MuRata; TaMin_C: -55°C; Polarized: N; SizeAreaWB_mm2: 3; U/M: EA; Value: 0.22uF; TaMax_C: 125°C; SizeZ_mm: 0.6; SizeX_mm: 1; SizeY_mm: 0.5; Cap_Case: 0402; Value2: 16V; CompType: Capacitor; AEC Qualified: Y; Cap_F: 220nF; AEC Category: Q200; ComponentLink1URL: http://psearch.en.murata.com/capacitor/product/GCM155R71C224KE02%23.pdf; Supplier Part Number 2: 81-GCM155R71C224KE2D; Supplier 2: Mouser; TempCo: X7R; RoHS: Y; MountType: SMT; Supplier 1: Digi-Key; PackageReference: 0402; Tolerance_%: 10%; SizeArea_mm2: 0.5; PartNumber: GCM155R71C224KE02D; VDC_V: 16V; ComponentLink1Description: Datasheet link; AEC Grade: 1; Supplier Part Number 1: 490-10671-1-ND; Technology: Ceramic
C4 = CMP-0006351-2: CAP, CERM, 0.1 uF, 16 V, +/- 10%, X7R, 0402; Manufacturer: MuRata; TaMin_C: -55°C; Polarized: N; SizeAreaWB_mm2: 3; Value1: Unknown; U/M: EA; Value: 0.1uF; TaMax_C: 125°C; SizeZ_mm: 0.6; SizeX_mm: 1; SizeY_mm: 0.5; Cap_Case: 0402; Value2: 16V; CompType: Capacitor; Cap_F: 100nF; AEC Category: Q200; Publisher: Texas Instruments; TempCo: X7R; Published: 2008-06-19; RoHS: Y; MountType: SMT; Supplier 1: Digi-Key; PackageReference: 0402; Tolerance_%: 10%; SizeArea_mm2: 0.5; LatestRevisionDate: 2017-03-09; PartNumber: GCM155R71C104KA55D; AEC Qualified: ?; VDC_V: 16V; ComponentLink1Description: Datasheet link; Supplier Part Number 1: 490-4759-2-ND; Technology: Ceramic; ComponentLink1URL: http://psearch.murata.com/capacitor/product/GCM155R71C104KA55%23.pdf
C6 = CMP-0006351-2: CAP, CERM, 0.1 uF, 16 V, +/- 10%, X7R, 0402; Manufacturer: MuRata; TaMin_C: -55°C; Polarized: N; SizeAreaWB_mm2: 3; Value1: Unknown; U/M: EA; Value: 0.1uF; TaMax_C: 125°C; SizeZ_mm: 0.6; SizeX_mm: 1; SizeY_mm: 0.5; Cap_Case: 0402; Value2: 16V; Cap_F: 100nF; AEC Category: Q200; Publisher: Texas Instruments; TempCo: X7R; Published: 2008-06-19; RoHS: Y; MountType: SMT; Supplier 1: Digi-Key; PackageReference: 0402; Tolerance_%: 10%; SizeArea_mm2: 0.5; CompType: Capacitor; LatestRevisionDate: 2017-03-09; PartNumber: GCM155R71C104KA55D; AEC Qualified: ?; VDC_V: 16V; ComponentLink1Description: Datasheet link; Supplier Part Number 1: 490-4759-2-ND; Technology: Ceramic; ComponentLink1URL: http://psearch.murata.com/capacitor/product/GCM155R71C104KA55%23.pdf
C13 = CMP-0007136-5: CAP, CERM, 1 uF, 16 V, +/- 10%, X7R, AEC-Q200 Grade 1, 0603; Manufacturer: MuRata; TaMin_C: -55°C; Polarized: N; SizeAreaWB_mm2: 4.68; Value1: Unknown; U/M: EA; Value: 1uF; TaMax_C: 125°C; SizeZ_mm: 1; SizeX_mm: 1.6; SizeY_mm: 0.8; Value2: 16V; SizeArea_mm2: 1.28; AEC Qualified: Y; Cap_F: 1µF; AEC Category: Q200; Supplier Part Number 2: 81-GCM188R71C105K64D; Publisher: Texas Instruments; Supplier 2: Mouser; TempCo: X7R; Published: 2008-06-19; RoHS: Y; MountType: SMT; Supplier 1: Digi-Key; PackageReference: 0603; Tolerance_%: 10%; Cap_Case: 0603; CompType: Capacitor; LatestRevisionDate: 2017-03-09; PartNumber: GCM188R71C105KA64D; VDC_V: 16V; ComponentLink1Description: Datasheet link; AEC Grade: 1; Supplier Part Number 1: 490-5241-6-ND; Technology: Ceramic; ComponentLink1URL: http://psearch.en.murata.com/capacitor/product/GCM188R71C105KA64%23.pdf
C14 = CMP-0007136-5: CAP, CERM, 1 uF, 16 V, +/- 10%, X7R, AEC-Q200 Grade 1, 0603; Manufacturer: MuRata; TaMin_C: -55°C; Polarized: N; SizeAreaWB_mm2: 4.68; Value1: Unknown; U/M: EA; Value: 1uF; TaMax_C: 125°C; SizeZ_mm: 1; SizeX_mm: 1.6; SizeY_mm: 0.8; Value2: 16V; SizeArea_mm2: 1.28; CompType: Capacitor; AEC Qualified: Y; Cap_F: 1µF; AEC Category: Q200; Supplier Part Number 2: 81-GCM188R71C105K64D; Publisher: Texas Instruments; Supplier 2: Mouser; TempCo: X7R; Published: 2008-06-19; RoHS: Y; MountType: SMT; Supplier 1: Digi-Key; PackageReference: 0603; Tolerance_%: 10%; Cap_Case: 0603; LatestRevisionDate: 2017-03-09; PartNumber: GCM188R71C105KA64D; VDC_V: 16V; ComponentLink1Description: Datasheet link; AEC Grade: 1; Supplier Part Number 1: 490-5241-6-ND; Technology: Ceramic; ComponentLink1URL: http://psearch.en.murata.com/capacitor/product/GCM188R71C105KA64%23.pdf
C17 C45 C52 C58 C65 C83 = CMP-0008017-2: CAP, CERM, 10 uF, 10 V, +/- 10%, X7R, 0805; Manufacturer: MuRata; TaMin_C: -55°C; Polarized: N; SizeAreaWB_mm2: 6.75; Value1: Unknown; U/M: EA; Value: 10uF; TaMax_C: 125°C; SizeZ_mm: 1.45; SizeX_mm: 2; SizeY_mm: 1.25; Cap_Case: 0805; Value2: 10V; SizeArea_mm2: 2.5; CompType: Capacitor; Cap_F: 10µF; AEC Category: Q200; Supplier Part Number 2: 06AC6014; Publisher: Texas Instruments; Supplier 2: Newark; Supplier Part Number 3: 81-GCM21BR71A106KE2L; TempCo: X7R; Supplier 3: Mouser; Published: 2008-06-19; RoHS: Y; MountType: SMT; Supplier 1: Digi-Key; PackageReference: 0805; Tolerance_%: 10%; LatestRevisionDate: 2017-03-09; PartNumber: GCM21BR71A106KE22L; AEC Qualified: ?; VDC_V: 10V; ComponentLink1Description: Datasheet link; Supplier Part Number 1: 490-10674-1-ND; Technology: Ceramic; ComponentLink1URL: http://www.murata.com/products/catalog/pdf/c03e.pdf
C87 C89 = CMP-0007134-5: CAP, CERM, 2.2 uF, 6.3 V, +/- 10%, X7R, AEC-Q200 Grade 1, 0603; Manufacturer: MuRata; TaMin_C: -55°C; Polarized: N; SizeAreaWB_mm2: 4.68; Value1: Unknown; U/M: EA; Value: 2.2uF; TaMax_C: 125°C; SizeZ_mm: 1; SizeX_mm: 1.6; SizeY_mm: 0.8; Value2: 6.3V; SizeArea_mm2: 1.28; AEC Qualified: Y; Cap_F: 2.2µF; AEC Category: Q200; Supplier Part Number 2: 81-GCM188R70J225KE2D; Publisher: Texas Instruments; Supplier 2: Mouser; TempCo: X7R; Published: 2008-06-19; RoHS: Y; MountType: SMT; Supplier 1: Digi-Key; PackageReference: 0603; Tolerance_%: 10%; Cap_Case: 0603; CompType: Capacitor; LatestRevisionDate: 2017-03-09; PartNumber: GCM188R70J225KE22D; VDC_V: 6.3V; ComponentLink1Description: Datasheet link; AEC Grade: 1; Supplier Part Number 1: 490-5316-1-ND; Technology: Ceramic; ComponentLink1URL: http://psearch.en.murata.com/capacitor/product/GCM188R70J225KE22%23.pdf
C101 = CMP-0006352-2: CAP, CERM, 0.01 uF, 25 V, +/- 10%, X7R, 0402; Manufacturer: MuRata; TaMin_C: -55°C; Polarized: N; SizeAreaWB_mm2: 3; Value1: Unknown; U/M: EA; Value: 0.01uF; TaMax_C: 125°C; SizeZ_mm: 0.6; SizeX_mm: 1; SizeY_mm: 0.5; Cap_Case: 0402; Value2: 25V; CompType: Capacitor; Cap_F: 10nF; AEC Category: Q200; Publisher: Texas Instruments; TempCo: X7R; Published: 2008-06-19; RoHS: Y; MountType: SMT; Supplier 1: Digi-Key; PackageReference: 0402; Tolerance_%: 10%; SizeArea_mm2: 0.5; LatestRevisionDate: 2017-03-09; PartNumber: GCM155R71E103KA37D; AEC Qualified: ?; VDC_V: 25V; ComponentLink1Description: Datasheet link; Supplier Part Number 1: 490-6043-2-ND; Technology: Ceramic; ComponentLink1URL: http://psearch.murata.com/capacitor/product/GCM155R71E103KA37%23.pdf